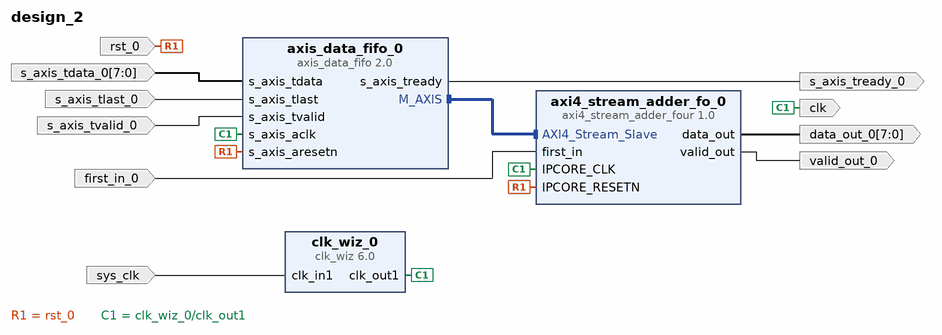
[diagram p0: block diagram of the top level]
# Vivado block design design_2, xc7z010clg400-1, Vivado 2023.2
create_bd_design design_2

create_bd_port -dir I -type clk sys_clk
create_bd_port -dir I -type rst rst_0
create_bd_port -dir O -from 7 -to 0 data_out_0
create_bd_port -dir O valid_out_0
create_bd_port -dir I -from 7 -to 0 s_axis_tdata_0
create_bd_port -dir I s_axis_tlast_0
create_bd_port -dir O s_axis_tready_0
create_bd_port -dir I s_axis_tvalid_0
create_bd_port -dir O -type clk clk
create_bd_port -dir I first_in_0

create_bd_cell -type ip -vlnv xilinx.com:ip:axis_data_fifo:2.0 axis_data_fifo_0
set_property -dict {CONFIG.HAS_TLAST 1} [get_bd_cells axis_data_fifo_0]
create_bd_cell -type ip -vlnv xilinx.com:ip:clk_wiz:6.0 clk_wiz_0
set_property -dict {CONFIG.USE_LOCKED false CONFIG.USE_RESET false} [get_bd_cells clk_wiz_0]
create_bd_cell -type ip -vlnv user.org:ip:axi4_stream_adder_four:1.0 axi4_stream_adder_fo_0

# ---- connections ----

connect_bd_intf_net [get_bd_intf_pins axis_data_fifo_0/M_AXIS] [get_bd_intf_pins axi4_stream_adder_fo_0/AXI4_Stream_Slave]
connect_bd_net -net IPCORE_RESETN_0_1 [get_bd_ports rst_0] \
  [get_bd_pins axis_data_fifo_0/s_axis_aresetn] [get_bd_pins axi4_stream_adder_fo_0/IPCORE_RESETN]
connect_bd_net [get_bd_pins axi4_stream_adder_fo_0/data_out] [get_bd_ports data_out_0]
connect_bd_net [get_bd_pins axi4_stream_adder_fo_0/valid_out] [get_bd_ports valid_out_0]
connect_bd_net [get_bd_pins axis_data_fifo_0/s_axis_tready] [get_bd_ports s_axis_tready_0]
connect_bd_net -net clk_in1_0_1 [get_bd_ports sys_clk] [get_bd_pins clk_wiz_0/clk_in1]
connect_bd_net [get_bd_pins clk_wiz_0/clk_out1] \
  [get_bd_pins axis_data_fifo_0/s_axis_aclk] [get_bd_ports clk] [get_bd_pins axi4_stream_adder_fo_0/IPCORE_CLK]
connect_bd_net -net first_in_0_1 [get_bd_ports first_in_0] [get_bd_pins axi4_stream_adder_fo_0/first_in]
connect_bd_net -net s_axis_tdata_0_1 [get_bd_ports s_axis_tdata_0] [get_bd_pins axis_data_fifo_0/s_axis_tdata]
connect_bd_net -net s_axis_tlast_0_1 [get_bd_ports s_axis_tlast_0] [get_bd_pins axis_data_fifo_0/s_axis_tlast]
connect_bd_net -net s_axis_tvalid_0_1 [get_bd_ports s_axis_tvalid_0] [get_bd_pins axis_data_fifo_0/s_axis_tvalid]

validate_bd_design
save_bd_design
